# EAGLE design Sensor AFE Explorer Rev2 (EAGLE 6.3)
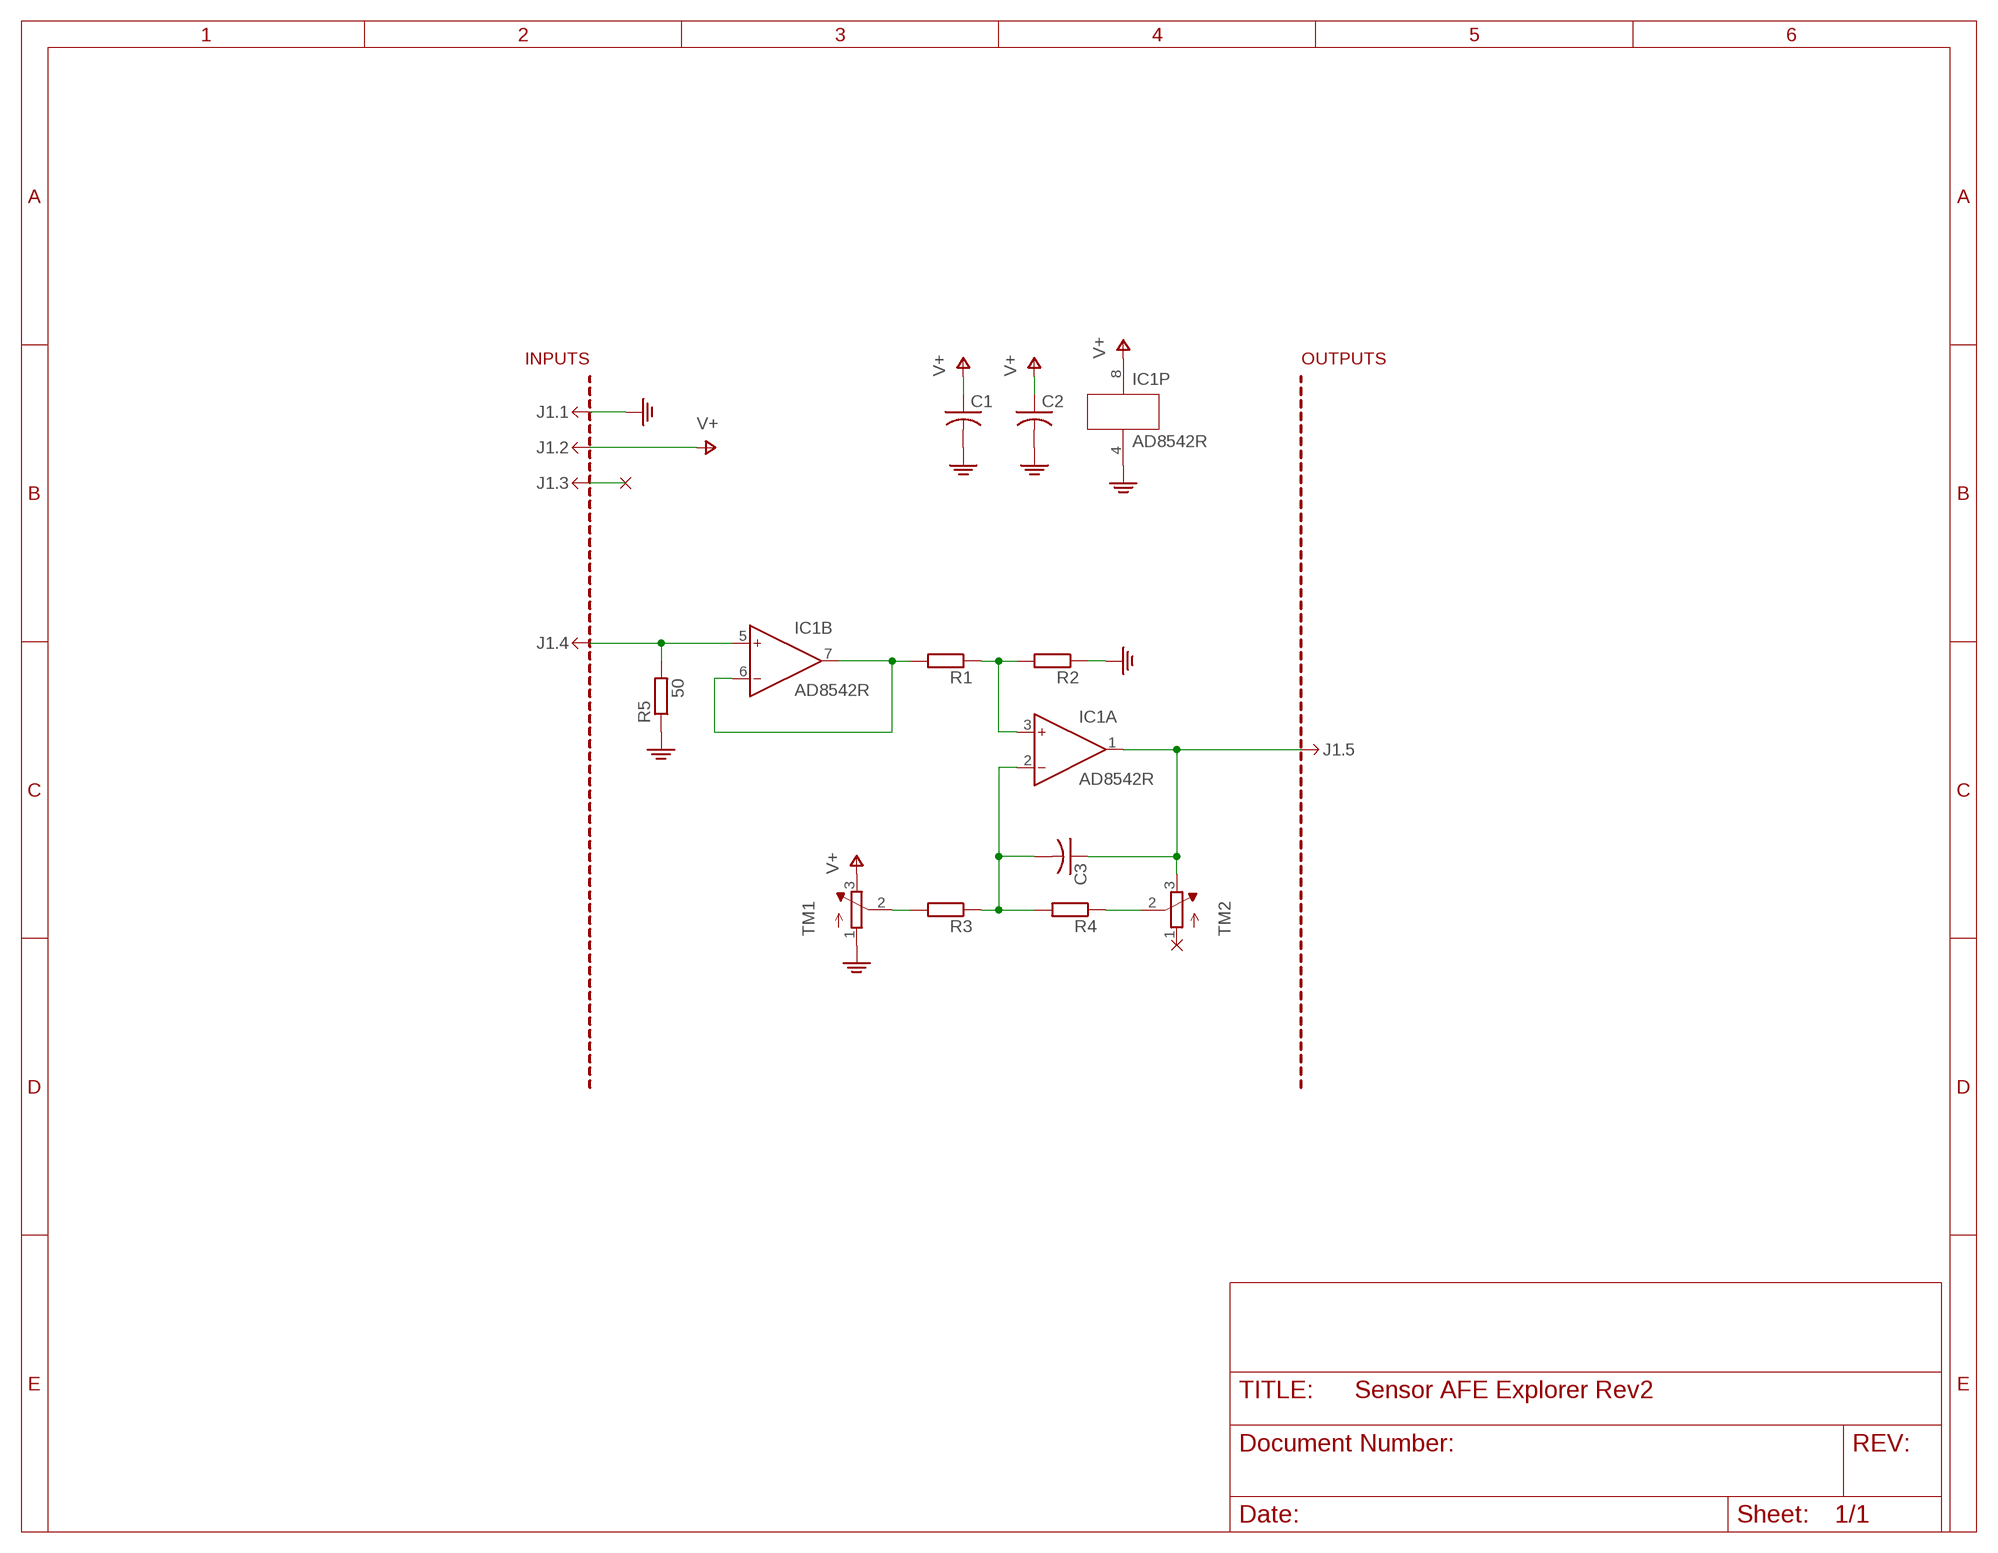
[diagram p0: schematic, sheet 1]

## Parts
C1  C-USC0805  [C0805]
C2  C-USC0805  [C0805]
C3  C-USC0805  [C0805]
IC1  AD8542R  [SO8]
J1.  MINIPCB_5P50X50  [MINIPCB_50X50MM]
R1  RESISTORSMD  [R0805]
R2  RESISTORSMD  [R0805]
R3  RESISTORSMD  [R0805]
R4  RESISTORSMD  [R0805]
R5  50  RESISTORSMD  [R0805]
TM1  TRIMPOT3386  [TRIM-3386]
TM2  TRIMPOT3386  [TRIM-3386]

## Nets
GND: C1.2 C2.2 IC1.4(P:V-) J1..1 R2.1 R5.1 TM1.1(A)
N$1: IC1.5(B:IN+) J1..4 R5.2
N$2: IC1.6(B:IN-) IC1.7(B:OUT) R1.2
N$3: IC1.3(A:IN+) R1.1 R2.2
N$4: C3.2 IC1.2(A:IN-) R3.1 R4.2
N$5: J1..3
N$6: R3.2 TM1.2(S)
N$7: R4.1 TM2.2(S)
N$8: C3.1 IC1.1(A:OUT) J1..5 TM2.3(E)
V+: C1.1 C2.1 IC1.8(P:V+) J1..2 TM1.3(E)
Unconnected: TM2.1(A)

## Library data of the parts
C1-C3 = nolan-utsa:C-US: CAPACITOR, American symbol
IC1 = analog-devices:AD8542: General-Purpose CMOS Rail-to-Rail Amplifiers Source: http://www.analog.com/static/imported-files/data_sheets/AD8541_8542_8544.pdf; MF: ALTERA CORPORATION; MPN: AD8542ARZ-REEL; OC_FARNELL: 1424150; OC_NEWARK: 59K6827
J1. = minipcb:MINIPCB_5P; PART_NUMBER: AFE Explorer; REVISION: 2
R1-R5 = minipcb:RESISTOR
TM1 TM2 = nolan-utsa:TRIMPOT: SMT trimmer potentiometer part number TC33X http://www.ladyada.net/library/eagle

## Board
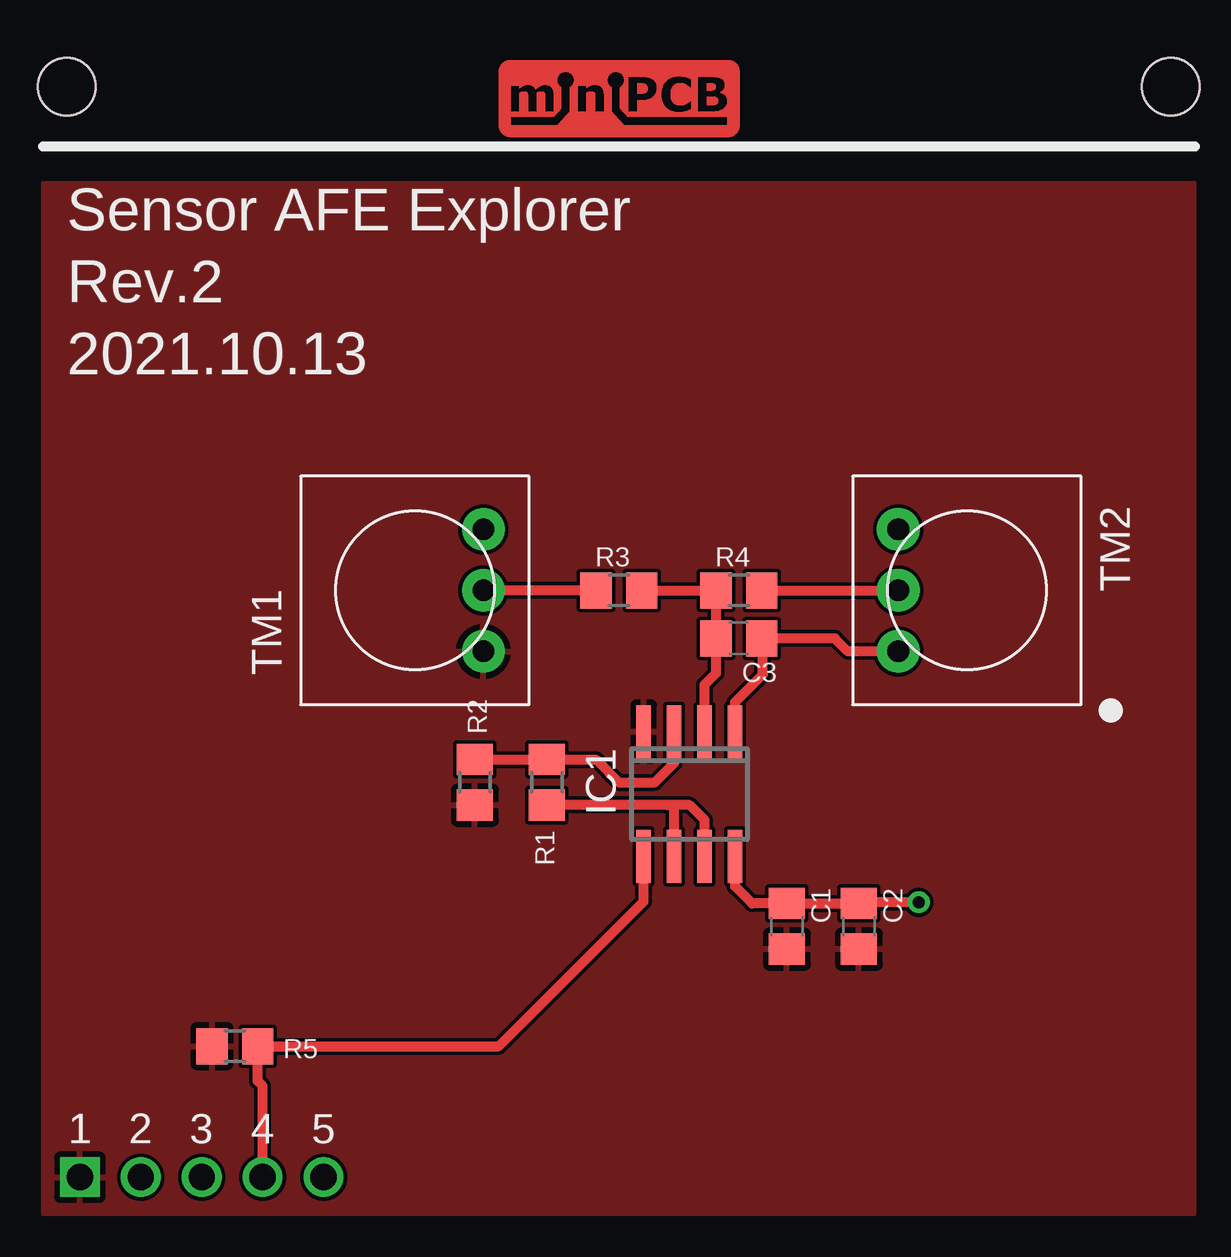
[diagram p1: board, top side]
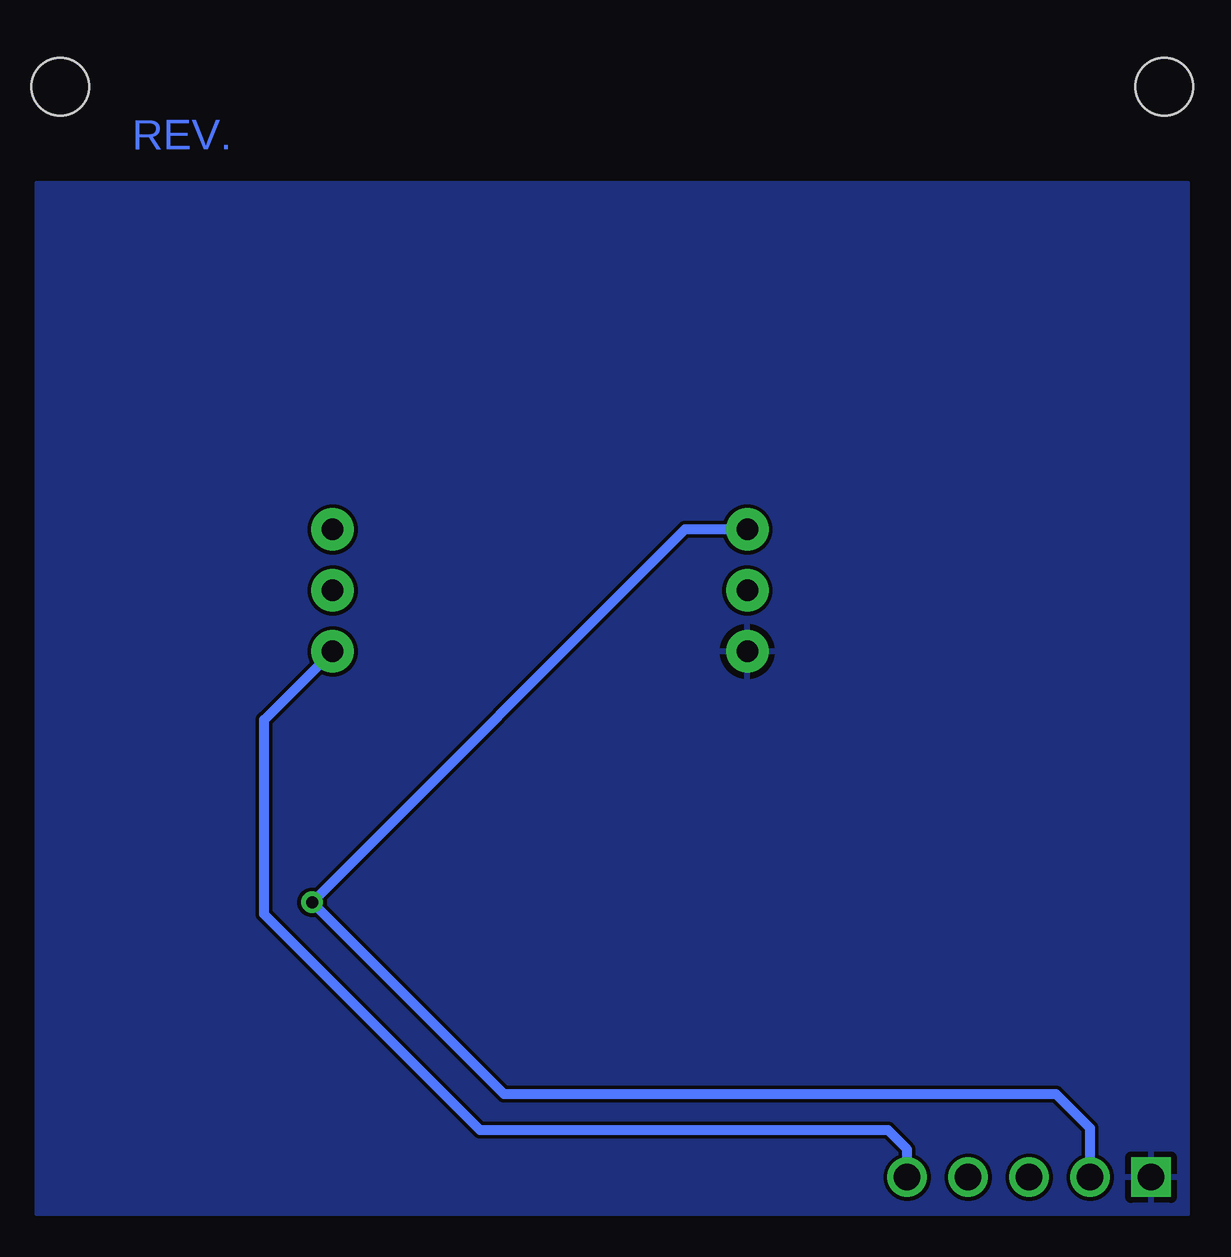
[diagram p2: board, bottom side, seen from below]

No outline drawn. Coordinates in mm, seen from the top.
Copper layers (1*16): Top 0.035mm / dielectric 1.5mm / Bottom 0.035mm
Design rules "default": minimum track width 6mil, minimum drill 0.35mm, track to track 6mil, track to pad 6mil, pad to pad 6mil, via to via 6mil, smd to smd 6mil, copper to edge 40mil, drill to drill 6mil, minimum pad ring 10mil, minimum via ring 8mil, stop-mask expansion 4mil, vias tented up to drill 0mil, thermal gap 10mil

### Footprints (pad centres in the part's own frame; a part is rotated, then mirrored left to right if it is on the bottom)
C0805 = smd 1.3 x 1.5: 1 -0.95,0; 2 0.95,0
SO8 = smd 0.6 x 2.2: 1 -1.905,-2.6; 2 -0.635,-2.6; 3 0.635,-2.6; 4 1.905,-2.6; 5 1.905,2.6; 6 0.635,2.6; 7 -0.635,2.6; 8 -1.905,2.6
MINIPCB_50X50MM = drill 1.1 square: 1 2.54,2.54 | drill 1.1: 2 5.08,2.54; 3 7.62,2.54; 4 10.16,2.54; 5 12.7,2.54 | hole 2.4: 48,48; 2,48
R0805 = smd 1.3 x 1.5: 1 -0.95,0; 2 0.95,0
TRIM-3386 = drill 0.9 pad 1.778: 1 -2.54,-2.857; 2 0,-2.857; 3 2.54,-2.857

### Placement (x,y rotation side)
C1  32,13 270 top
C2  35,13 270 top
C3  30,25 180 top
IC1  27.94,18.51 180 top
J1.  0,0 0 top
R1  22,19 270 top
R2  19,19 90 top
R3  25,27 180 top
R4  30,27 180 top
R5  9,8 0 top
TM1  16.5,27 90 top
TM2  39.5,27 270 top

### Tracks (layer width: path | path; a pad name or v marks a point on that pad's centre or on a via)
GND
  pour Top: 1,1 1,44 49,44 49,1
  pour Bottom: 1,1 1,44 49,44 49,1
N$1
  Top 0.406: J1..4 10.16,6.34 9.95,6.55 R5.2 20,8 26.04,14.04 IC1.5
N$2
  Top 0.406: IC1.7 28.57,17.43 27.95,18.05 27.3,18.05 | R1.2 27,18.05 27.3,18.05 | IC1.6 27.3,18.05
N$3
  Top 0.406: R2.2 R1.1 24.05,19.95 25,19 26.5,19 27.3,19.8 IC1.3
N$4
  Top 0.406: R3.1 R4.2 C3.2 29.05,23.55 28.57,23.07 IC1.2
N$6
  Top 0.406: R3.2 TM1.2
N$7
  Top 0.406: R4.1 TM2.2
N$8
  Top 0.406: IC1.1 29.84,22.34 31,23.5 31,24.95 C3.1 34,25 34.54,24.46 TM2.3
  Bottom 0.406: J1..5 12.7,3.7 13.5,4.5 30.5,4.5 39.5,13.5 39.5,21.6 TM2.3
V+  (via drill 0.5)
  Top 0.406: v37.5,14 35.05,14 C2.1 C1.1 30.55,13.95 29.84,14.65 IC1.8
  Bottom 0.406: J1..2 5.08,4.58 6.5,6 29.5,6 v37.5,14 21.96,29.54 TM1.3

### Text on the board
tPlace: Sensor AFE Explorer | Rev.2 | 2021.10.13